# EAGLE design scheme (EAGLE 6.4)
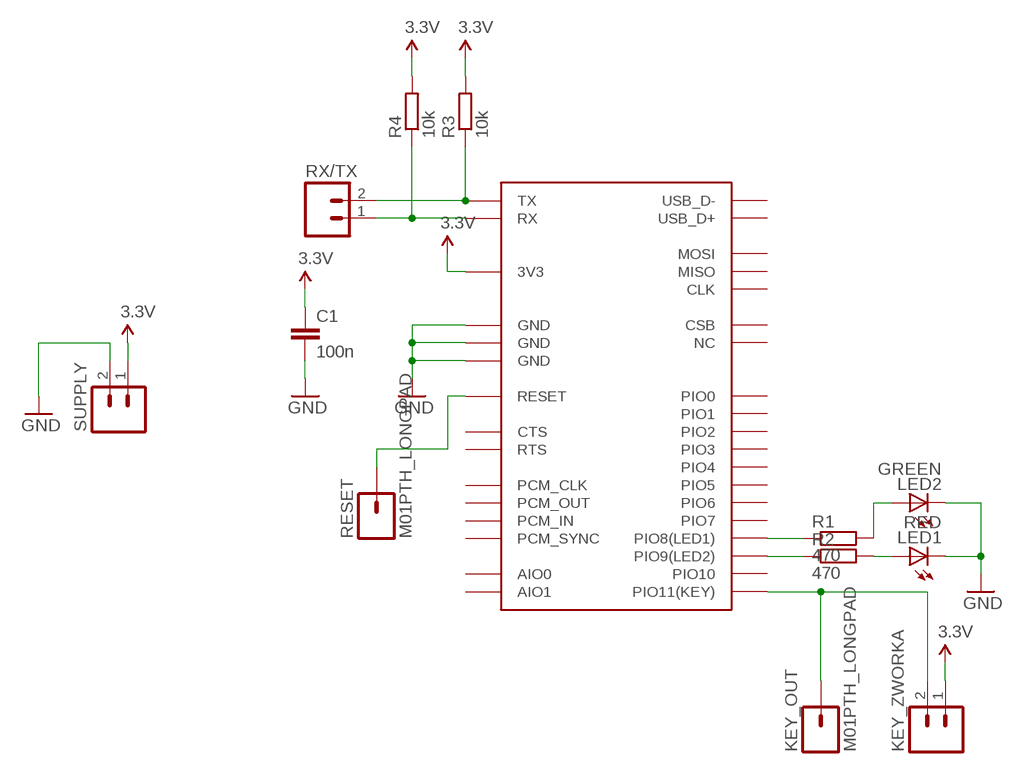
[diagram p0: schematic, sheet 1]

## Parts
C1  100n  C-EUC0805  [C0805]
IC1  HC-05  [HC-05]
KEY_OUT  M01PTH_LONGPAD  [1X01_LONGPAD]
KEY_ZWORKA  M02  [1X02_LONGPADS]
LED1  RED  LEDCHIPLED_0805  [CHIPLED_0805]
LED2  GREEN  LEDCHIPLED_0805  [CHIPLED_0805]
R1  470  R-EU_R0805  [R0805]
R2  470  R-EU_R0805  [R0805]
R3  10k  R-EU_R0805  [R0805]
R4  10k  R-EU_R0805  [R0805]
RESET  M01PTH_LONGPAD  [1X01_LONGPAD]
RX/TX  M02  [1X02_LONGPADS]
SUPPLY  M02  [1X02_LONGPADS]

## Nets
3.3V: C1.1 IC1.3V3 KEY_ZWORKA.1 R3.2 R4.2 SUPPLY.1
GND: C1.2 IC1.GND@1(GND) IC1.GND@2(GND) IC1.GND@3(GND) LED1.C LED2.C SUPPLY.2
N$1: IC1.PIO11(KEY) KEY_OUT.1 KEY_ZWORKA.2
N$2: IC1.PIO8(LED1) R1.1
N$3: IC1.PIO9(LED2) R2.1
N$4: LED2.A R1.2
N$5: LED1.A R2.2
N$6: IC1.RESET RESET.1
N$7: IC1.TX R3.1 RX/TX.2
N$8: IC1.RX R4.1 RX/TX.1
Unconnected: IC1.AIO0 IC1.AIO1 IC1.CLK IC1.CSB IC1.CTS IC1.MISO IC1.MOSI IC1.NC IC1.PCM_CLK IC1.PCM_IN IC1.PCM_OUT IC1.PCM_SYNC IC1.PIO0 IC1.PIO1 IC1.PIO2 IC1.PIO3 IC1.PIO4 IC1.PIO5 IC1.PIO6 IC1.PIO7 IC1.PIO10 IC1.RTS IC1.USB_D+ IC1.USB_D-

## Library data of the parts
C1 = rcl:C-EU: CAPACITOR, European symbol
IC1 = HC-05:HC-05: HC-05 Bluetooth module, range 10m
KEY_OUT RESET = SparkFun:M01: Header 1 Standard 1-pin 0.1" header. Use with straight break away headers (SKU : PRT-00116), right angle break away headers (PRT-00553), swiss pins (PRT-00743), machine pins (PRT-00117), and female headers (PRT-00115).
KEY_ZWORKA RX/TX SUPPLY = SparkFun:M02: Header 2 Standard 2-pin 0.1" header. Use with straight break away headers (SKU : PRT-00116), right angle break away headers (PRT-00553), swiss pins (PRT-00743), machine pins (PRT-00117), and female headers (PRT-00115). Molex polarized connector foot print use with SKU : PRT-08233 with associated crimp pins and housings.
LED1 LED2 = led:LED: LED OSRAM: - CHIPLED LG R971, LG N971, LY N971, LG Q971, LY Q971, LO R971, LY R971 LH N974, LH R974 LS Q976, LO Q976, LY Q976 LO Q996 - Hyper CHIPLED LW Q18S LB Q993, LB Q99A, LB R99A - SideLED LS A670, LO A670, LY A670, LG A670, LP A670 LB A673, LV A673, LT A673, LW A673 LH A674 LY A675 LS A676, LA A676, LO A676, LY A676, LW A676 LS A679, LY A679, LG A679 - Hyper Micro SIDELED® LS Y876, LA Y876, LO Y876, LY Y876 LT Y87S - SmartLED LW L88C, LW L88S LB L89C, LB L89S, LG L890 LS L89K, LO L89K, LY L89K LS L896, LA L896, LO L896, LY L896 - TOPLED LS T670, LO T670, LY T670, LG T670, LP T670 LSG T670, LSP T670, LSY T670, LOP T670, LYG T670 LG T671, LOG T671, LSG T671 LB T673, LV T673, LT T673, LW T673 LH T674 LS T676, LA T676, LO T676, LY T676, LB T676, LH T676, LSB T676, LW T676 LB T67C, LV T67C, LT T67C, LS T67K, LO T67K, LY T67K, LW E67C LS E67B, LA E67B, LO E67B, LY E67B, LB E67C, LV E67C, LT E67C LW T67C LS T679, LY T679, LG T679 LS T770, LO T770, LY T770, LG T770, LP T770 LB T773, LV T773, LT T773, LW T773 LH T774 LS E675, LA E675, LY E675, LS T675 LS T776, LA T776, LO T776, LY T776, LB T776 LHGB T686 LT T68C, LB T68C - Hyper Mini TOPLED® LB M676 - Mini TOPLED Santana® LG M470 LS M47K, LO M47K, LY M47K Source: http://www.osram.convergy.de LUXEON: - LUMILED® LXK2-PW12-R00, LXK2-PW12-S00, LXK2-PW14-U00, LXK2-PW14-V00 LXK2-PM12-R00, LXK2-PM12-S00, LXK2-PM14-U00 LXK2-PE12-Q00, LXK2-PE12-R00, LXK2-PE12-S00, LXK2-PE14-T00, LXK2-PE14-U00 LXK2-PB12-K00, LXK2-PB12-L00, LXK2-PB12-M00, LXK2-PB14-N00, LXK2-PB14-P00, LXK2-PB14-Q00 LXK2-PR12-L00, LXK2-PR12-M00, LXK2-PR14-Q00, LXK2-PR14-R00 LXK2-PD12-Q00, LXK2-PD12-R00, LXK2-PD12-S00 LXK2-PH12-R00, LXK2-PH12-S00 LXK2-PL12-P00, LXK2-PL12-Q00, LXK2-PL12-R00 Source: www.luxeon.com KINGBRIGHT: KA-3528ASYC Source: www.kingbright.com
R1-R4 = rcl:R-EU_: RESISTOR, European symbol

## Board
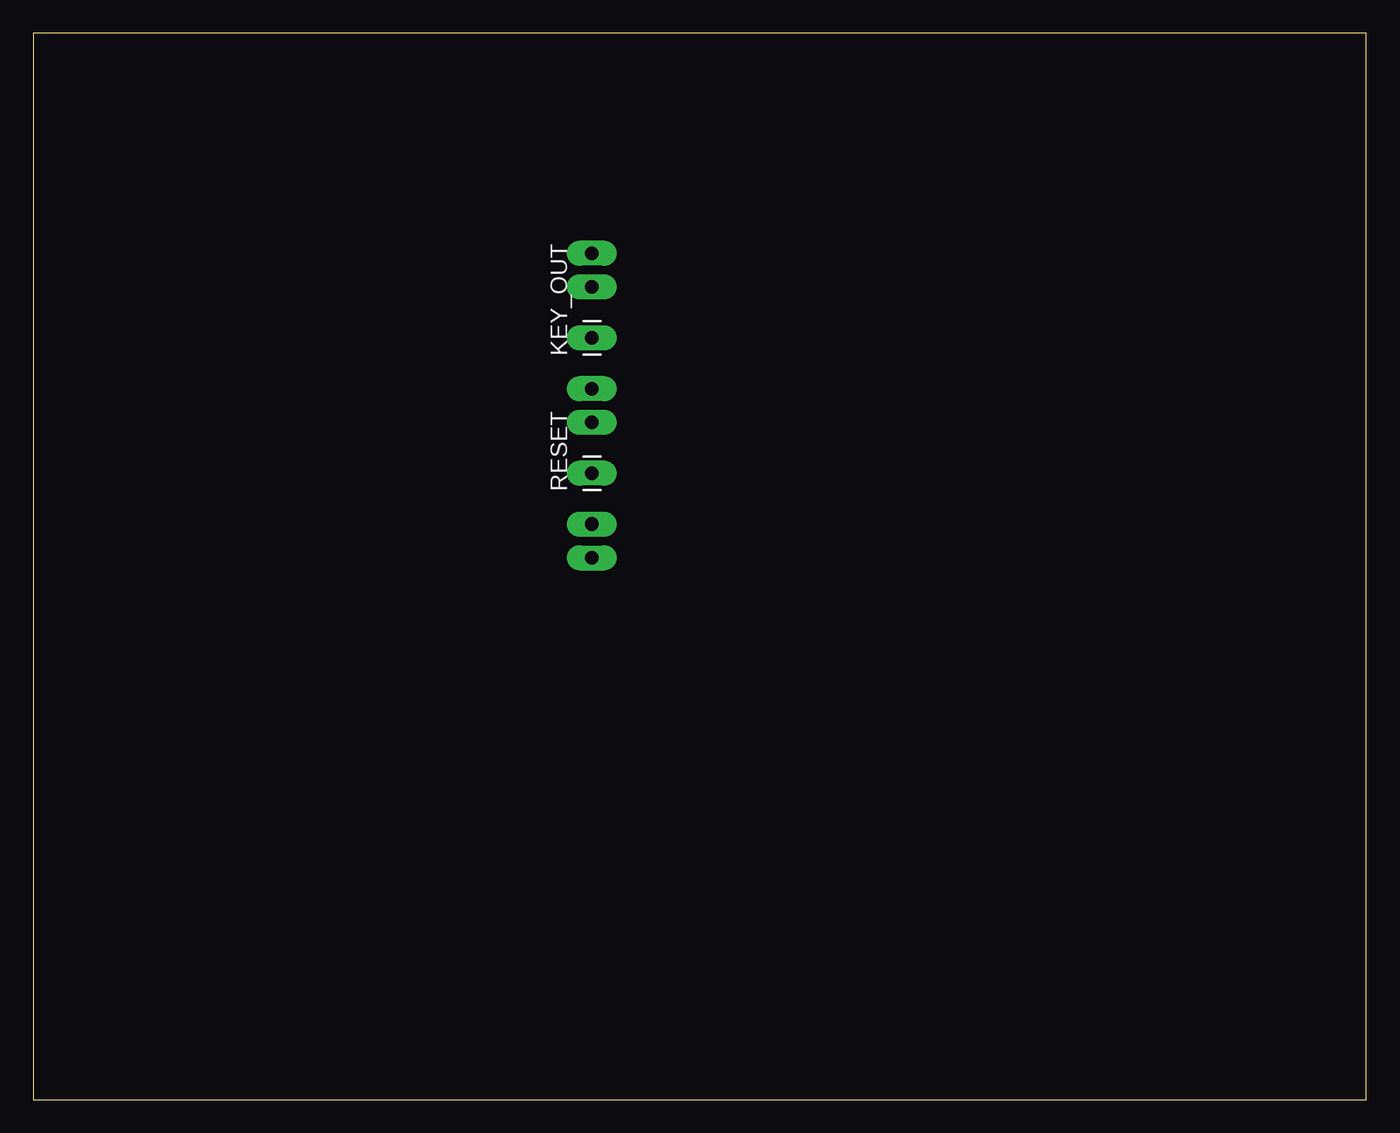
[diagram p1: board, top side]
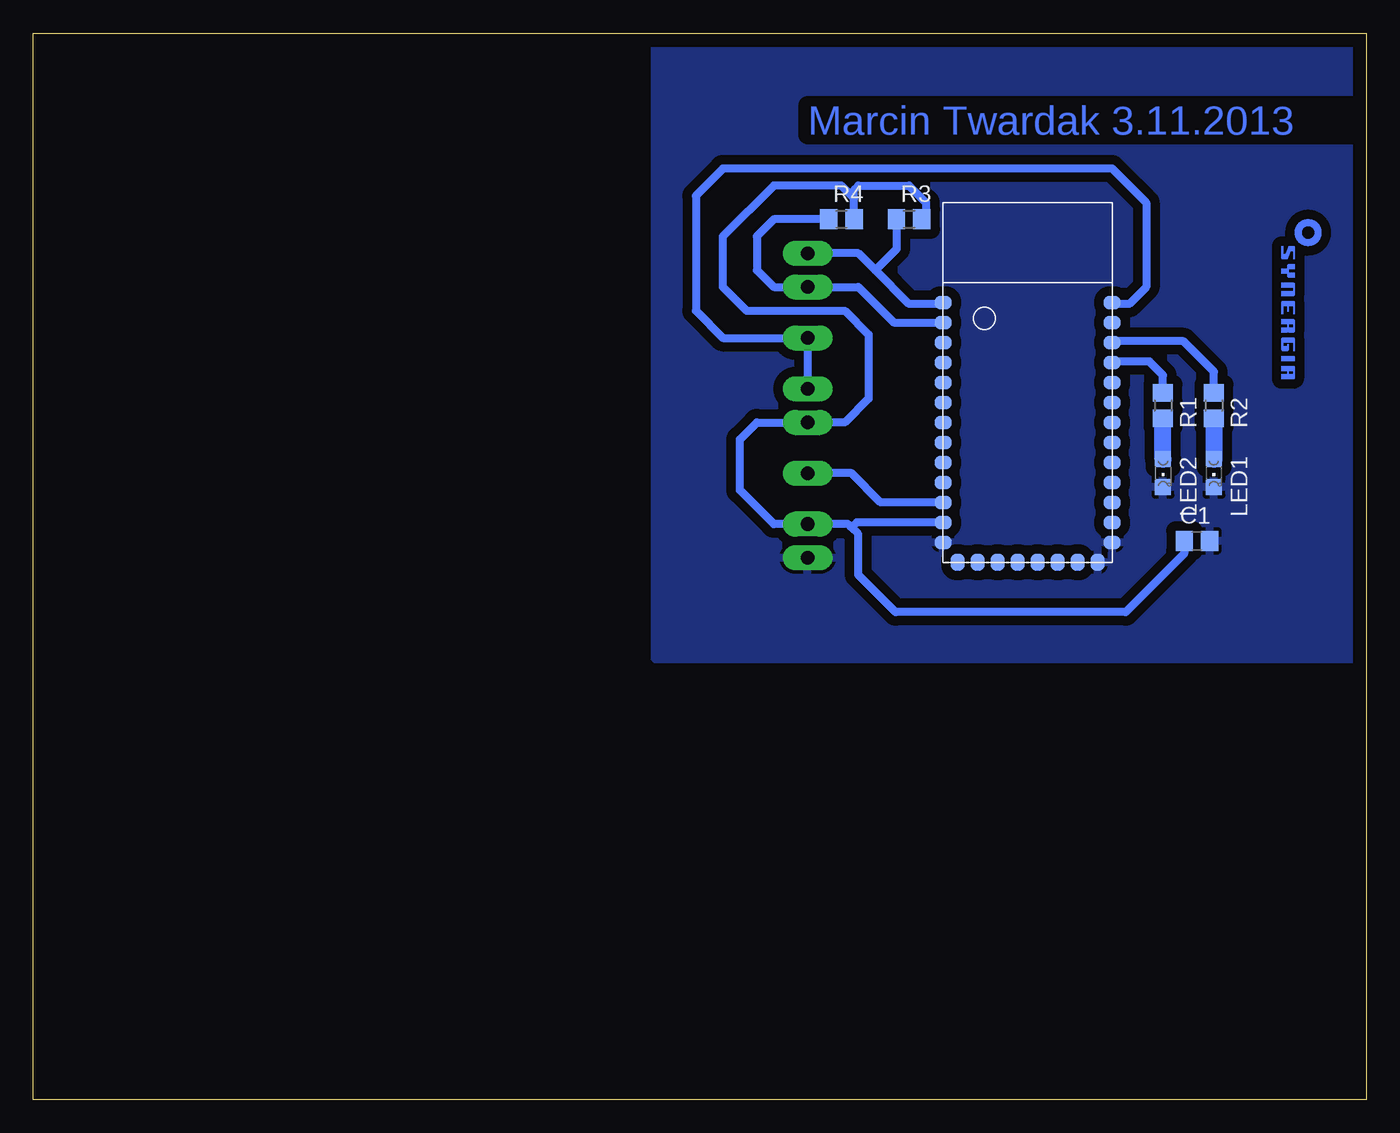
[diagram p2: board, bottom side, seen from below]

Size 100 x 80 mm. Coordinates in mm from the lower left corner, seen from the top.
Outline: 0,0 100,0 100,80 0,80 0,0
Copper layers (1*16): Top 0.035mm / dielectric 1.5mm / Bottom 0.035mm
Design rules "default": minimum track width 10mil, minimum drill 24mil, track to track 8mil, track to pad 8mil, pad to pad 8mil, via to via 8mil, smd to smd 8mil, copper to edge 40mil, drill to drill 8mil, minimum pad ring 10mil, minimum via ring 8mil, stop-mask expansion 4mil, vias tented up to drill 0mil, thermal gap 10mil

### Footprints (pad centres in the part's own frame; a part is rotated, then mirrored left to right if it is on the bottom)
C0805 = smd 1.3 x 1.5: 1 -0.95,0; 2 0.95,0
HC-05 = smd 1.27 x 1: 3V3 0,-24; AIO0 0,-19.5; AIO1 0,-21; CTS 0,-10.5; GND@1 0,-25.5; GND@3 12.7,-25.5; PCM_CLK 0,-13.5; PCM_IN 0,-16.5; PCM_OUT 0,-15; PCM_SYNC 0,-18; PIO0 12.7,-24; PIO1 12.7,-22.5; PIO2 12.7,-21; PIO3 12.7,-19.5; PIO4 12.7,-18; PIO5 12.7,-16.5; PIO6 12.7,-15; PIO7 12.7,-13.5; PIO8(LED1) 12.7,-12; PIO9(LED2) 12.7,-10.5; PIO10 12.7,-9; PIO11(KEY) 12.7,-7.5; RESET 0,-22.5; RTS 0,-12; RX 0,-9; TX 0,-7.5 | smd 1 x 1.27: CLK 8.6,-27; CSB 4.1,-27; GND@2 11.6,-27; MISO 7.1,-27; MOSI 5.6,-27; NC 1.1,-27; USB_D+ 10.1,-27; USB_D- 2.6,-27
1X01_LONGPAD = drill 1.016 pad 1.88 long: 1 0,0
1X02_LONGPADS = drill 1.016 pad 1.88 long: 1 0,0; 2 2.54,0
CHIPLED_0805 = smd 1.2 x 1.2: A 0,-1.05; C 0,1.05
R0805 = smd 1.3 x 1.5: 1 -0.95,0; 2 0.95,0

### Placement (x,y rotation side)
C1  12.7,41.91 0 bottom
IC1  31.75,67.31 0 bottom
KEY_OUT  41.91,57.15 90 top
KEY_ZWORKA  41.91,50.8 90 top
LED1  11.43,46.99 180 bottom
LED2  15.24,46.99 180 bottom
R1  15.24,52.07 270 bottom
R2  11.43,52.07 270 bottom
R3  34.29,66.04 0 bottom
R4  39.37,66.04 0 bottom
RESET  41.91,46.99 90 top
RX/TX  41.91,60.96 90 top
SUPPLY  41.91,43.18 270 top
U$1  [SYNERGIA_12MM]  6.35,66.04 270 bottom

### Tracks (layer width: path | path; a pad name or v marks a point on that pad's centre or on a via)
3.3V
  Bottom 0.61: C1.1 13.65,40.96 18.03,36.58 35.31,36.58 38.1,39.37 38.1,42.42 38.61,42.93 | 38.61,42.93 38.86,43.18 SUPPLY.1 44.45,43.18 46.99,45.72 46.99,49.53 45.72,50.8 KEY_ZWORKA.1 39.12,50.8 37.34,52.58 37.34,57.4 39.12,59.18 46.48,59.18 48.26,60.96 48.26,64.77 44.45,68.58 39.37,68.58 38.42,67.63 | IC1.3V3 38.22,43.31 38.61,42.93 | R3.2 33.02,66.36 33.02,67.31 34.29,68.58 38.1,68.58 38.42,68.26 38.42,67.63 | R4.2 38.42,67.63
GND
  pour Bottom (isolate 0.711): 0,80.01 0,33.02 53.34,33.02 53.34,80.01
N$1
  Bottom 0.61: KEY_ZWORKA.2 KEY_OUT.1 48.26,57.15 50.29,59.18 50.29,67.82 48.26,69.85 19.05,69.85 16.51,67.31 16.51,60.96 17.78,59.69 18.93,59.69 IC1.PIO11(KEY)
N$2
  Bottom 0.61: R1.1 15.24,54.36 16.26,55.37 18.99,55.37 IC1.PIO8(LED1)
N$3
  Bottom 0.61: R2.1 11.43,54.61 13.72,56.9 18.96,56.9 IC1.PIO9(LED2)
N$4
  Bottom 1.27: LED2.A R1.2
N$5
  Bottom 1.27: R2.2 LED1.A
N$6
  Bottom 0.61: IC1.RESET 36.43,44.81 38.61,46.99 RESET.1
N$7
  Bottom 0.61: IC1.TX 31.87,59.69 34.29,59.69 36.83,62.23 | 36.83,62.23 38.1,63.5 RX/TX.2 | R3.1 35.24,63.82 36.83,62.23
N$8
  Bottom 0.61: IC1.RX 35.45,58.31 38.1,60.96 RX/TX.1 44.45,60.96 45.72,62.23 45.72,64.77 44.45,66.04 R4.1

### Text on the board
Bottom: Marcin Twardak 3.11.2013